# EAGLE design SSB Transceiver_MC1496 DSB Modulator (EAGLE 9.4.2)
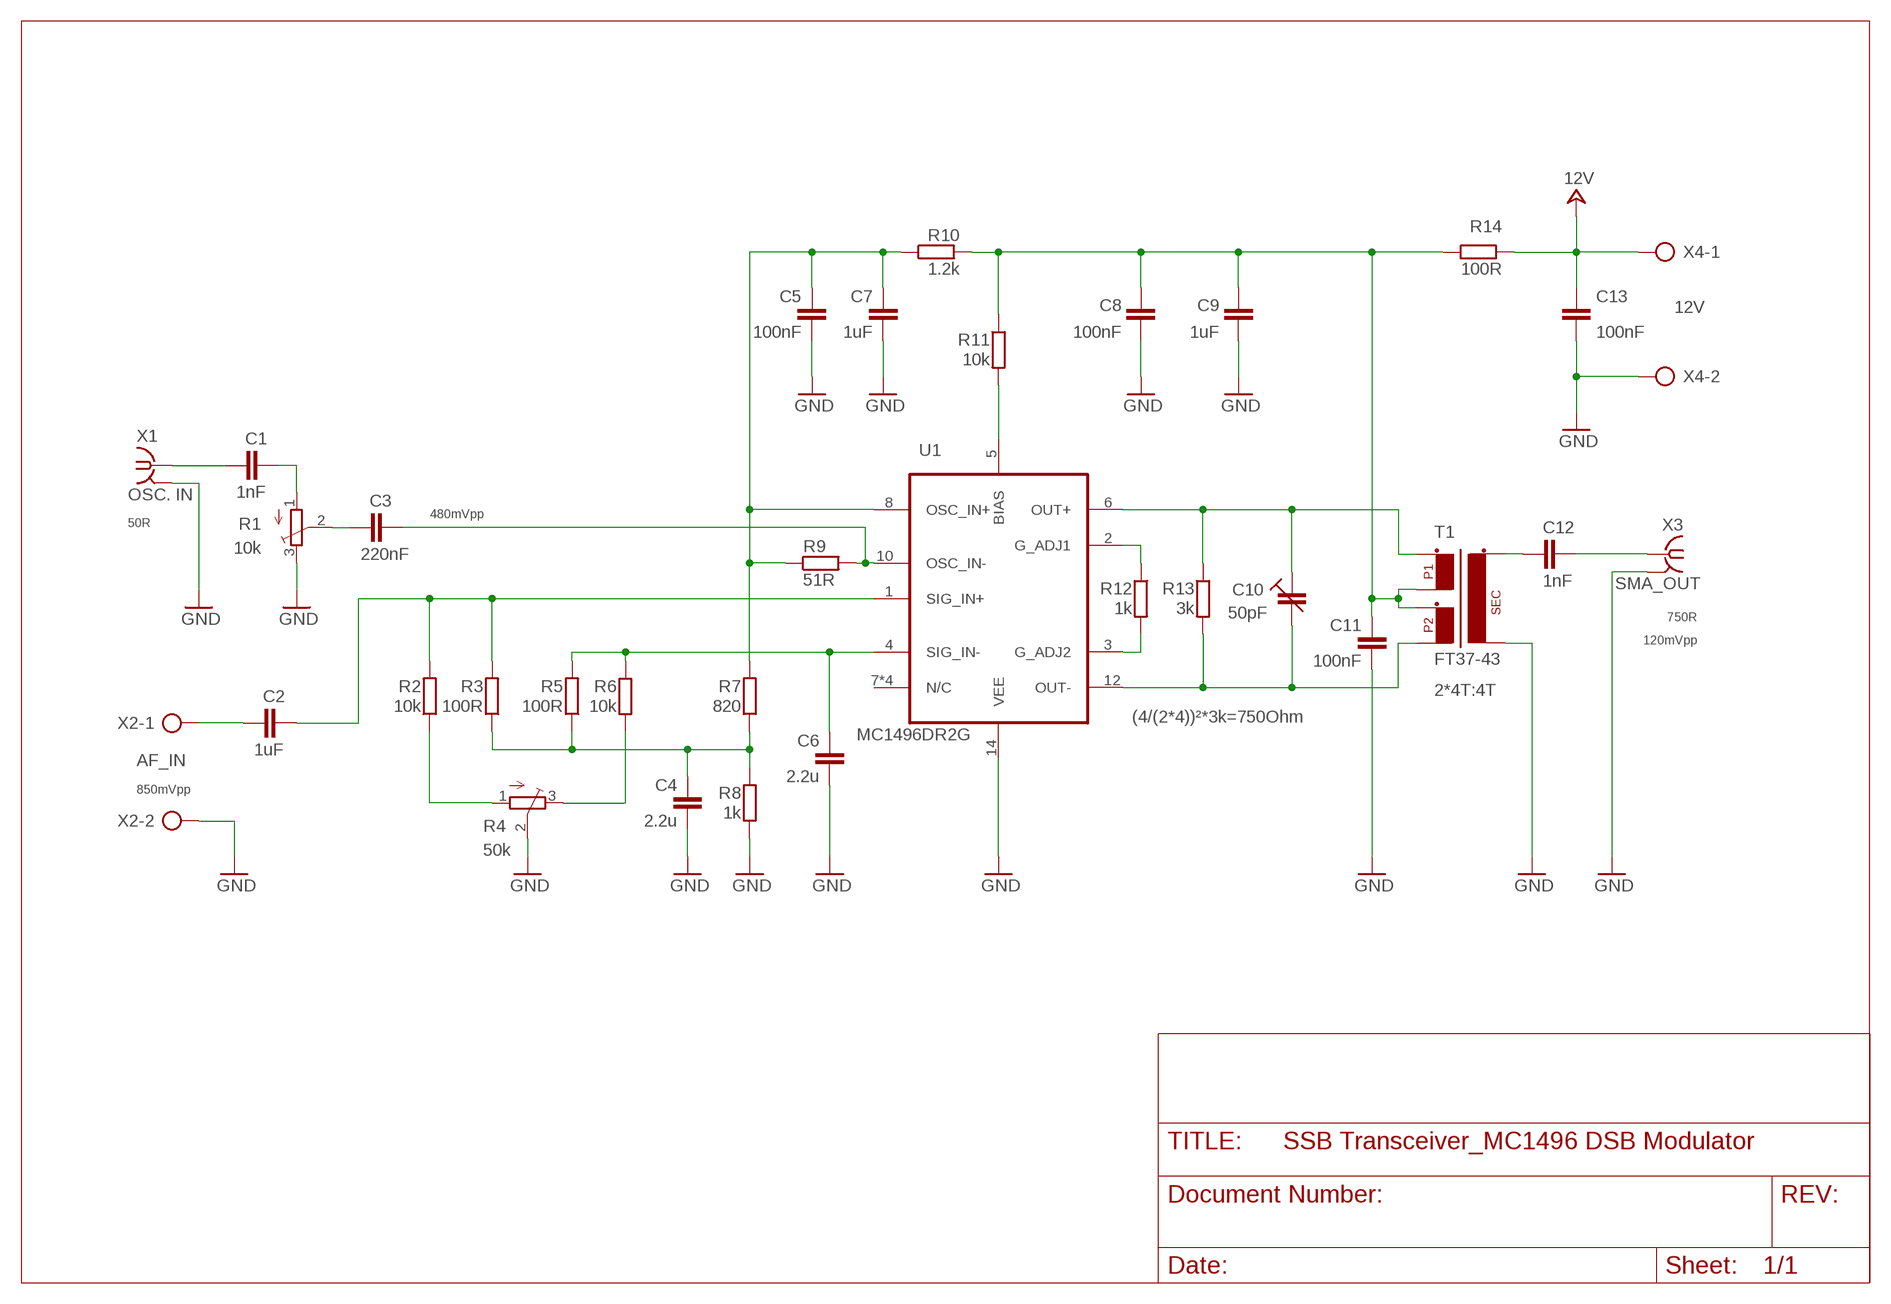
[diagram p0: schematic, sheet 1]

## Parts
C1  1nF  C-EUC0805  [C0805]
C2  1uF  C-EUC0805  [C0805]
C3  220nF  C-EUC0805  [C0805]
C4  2.2u  C-EUC0805  [C0805]
C5  100nF  C-EUC0805  [C0805]
C6  2.2u  C-EUC0805  [C0805]
C7  1uF  C-EUC0805  [C0805]
C8  100nF  C-EUC0805  [C0805]
C9  1uF  C-EUC0805  [C0805]
C10  50pF  VARIABLECAP  [VARIABLECAP-SMD]
C11  100nF  C-EUC0805  [C0805]
C12  1nF  C-EUC0805  [C0805]
C13  100nF  C-EUC0805  [C0805]
R1  10k  TRIM_EU-3223G  [3223G]
R2  10k  R-EU_R0805  [R0805]
R3  100R  R-EU_R0805  [R0805]
R4  50k  TRIM_EU-3223G  [3223G]
R5  100R  R-EU_R0805  [R0805]
R6  10k  R-EU_R0805  [R0805]
R7  820  R-EU_R0805  [R0805]
R8  1k  R-EU_R0805  [R0805]
R9  51R  R-EU_R0805  [R0805]
R10  1.2k  R-EU_R0805  [R0805]
R11  10k  R-EU_R0805  [R0805]
R12  1k  R-EU_R0805  [R0805]
R13  3k  R-EU_R0805  [R0805]
R14  100R  R-EU_R0805  [R0805]
T1  FT37-43  FT37-43CENTERTAP  [FT37-43CENTERTAPSMD]
U1  MC1496DR2G  [SOIC127P600X175-14N]
X1  OSC. IN  SMA-142-0711-821/826  [J502-ND-142-0711-821/826]
X2  AF_IN  AK300/2  [AK300/2]
X3  SMA_OUT  SMA-142-0711-821/826  [J502-ND-142-0711-821/826]
X4  12V  AK300/2  [AK300/2]

## Nets
+24V: C13.2 R14.2 X4.1 ; supply symbol labelled 12V
GND: C4.1 C5.1 C6.1 C7.1 C8.1 C9.1 C11.1 C13.1 R1.3(E) R4.2(S) R8.1 T1.S$2(S2) U1.14(VEE) X1.G@1 X1.G@2 X1.G@3 X1.G@4 X2.2 X3.G@1 X3.G@2 X3.G@3 X3.G@4 X4.2
N$1: C1.1 X1.1
N$2: C12.2 X3.1
N$3: C1.2 R1.1(A)
N$4: C3.1 R1.2(S)
N$5: C8.2 C9.2 C11.2 R10.2 R11.1 R14.1 T1.P$2(P1_2) T1.P$3(P2_1)
N$6: C12.1 T1.S$1(S1)
N$7: C10.P$1(E) R13.1 T1.P$1(P1_1) U1.6(OUT+)
N$8: C10.P$2(A) R13.2 T1.P$4(P2_2) U1.12(OUT-)
N$9: R12.2 U1.3(G_ADJ2)
N$10: R12.1 U1.2(G_ADJ1)
N$11: C3.2 R9.2 U1.10(OSC_IN-)
N$13: R11.2 U1.5(BIAS)
N$14: R2.1 R4.1(A)
N$15: R4.3(E) R6.2
N$16: C6.2 R5.2 R6.1 U1.4(SIG_IN-)
N$17: C2.2 R2.2 R3.2 U1.1(SIG_IN+)
N$18: C4.2 R3.1 R5.1 R7.1 R8.2
N$19: C2.1 X2.1
N$21: C5.2 C7.2 R7.2 R9.1 R10.1 U1.8(OSC_IN+)
Unconnected: U1.7(N/C) U1.9(N/C) U1.11(N/C) U1.13(N/C)

## Notes on the sheet
- 480mVpp
- 50R
- 750R
- 120mVpp
- 2*4T:4T
- (4/(2*4))²*3k=750Ohm
- 850mVpp

## Library data of the parts
C1-C9 C11-C13 = rcl:C-EU: CAPACITOR, European symbol; SPICEPREFIX: C
C10 = Ham Radio:VARIABLECAP
R1 R4 = pot:TRIM_EU-: POTENTIOMETER
R2 R3 R5-R14 = rcl:R-EU_: RESISTOR, European symbol; SPICEPREFIX: R
T1 = Ham Radio:FT37-43CENTERTAP
U1 = Ham Radio:MC1496DR2G; AVAILABILITY: Unavailable; DESCRIPTION: RF IC Modulator/Demodulator FM 300MHz 14-SOIC; MF: ON Semiconductor; MP: MC1496DR2G; PACKAGE: SOIC-14 ON Semiconductor; PRICE: None
X1 X3 = con-coax:SMA-: SMA 50 Ohm End Launch Jack Receptacle - Round Contact Johnson Components Source: www.johnsoncomponents.com .. J502-ND.pdf; MF: JOHNSON COMPONENTS; MPN: 142-0711-821; OC_FARNELL: 1019328; OC_NEWARK: 16F3627
X2 X4 = con-ptr500:AK300/2: CONNECTOR; OC_FARNELL: unknown; OC_NEWARK: unknown

## Board
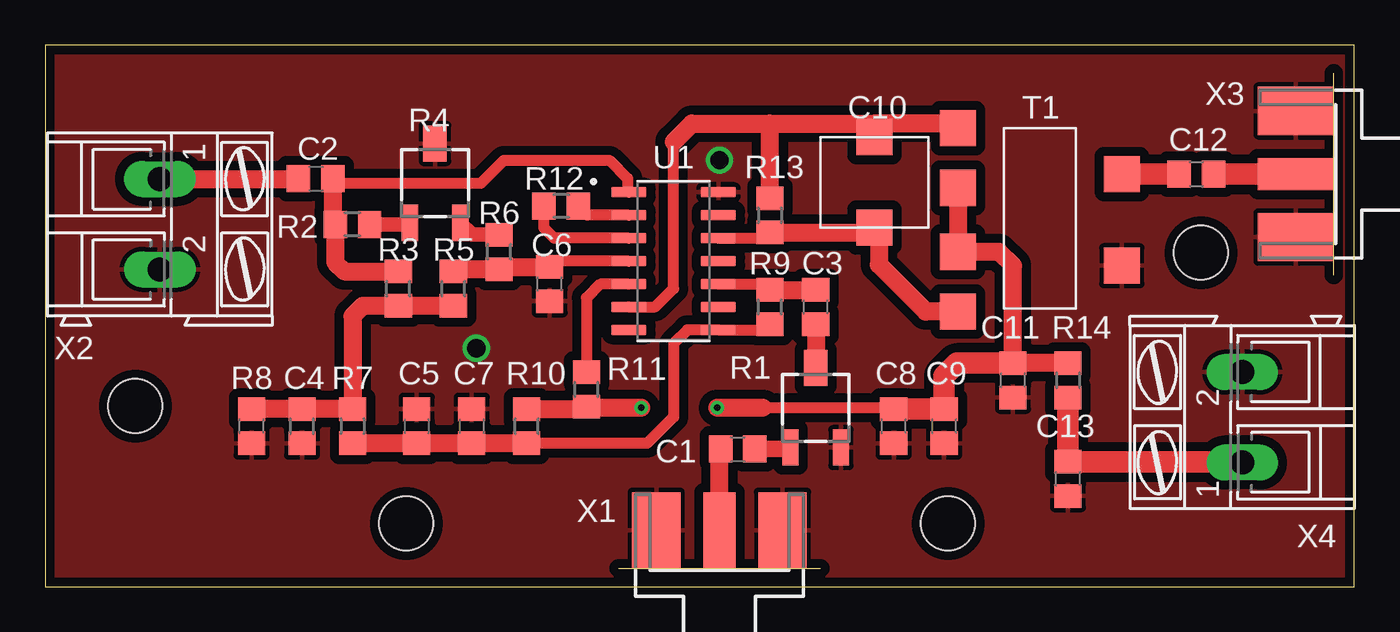
[diagram p1: board, top side]
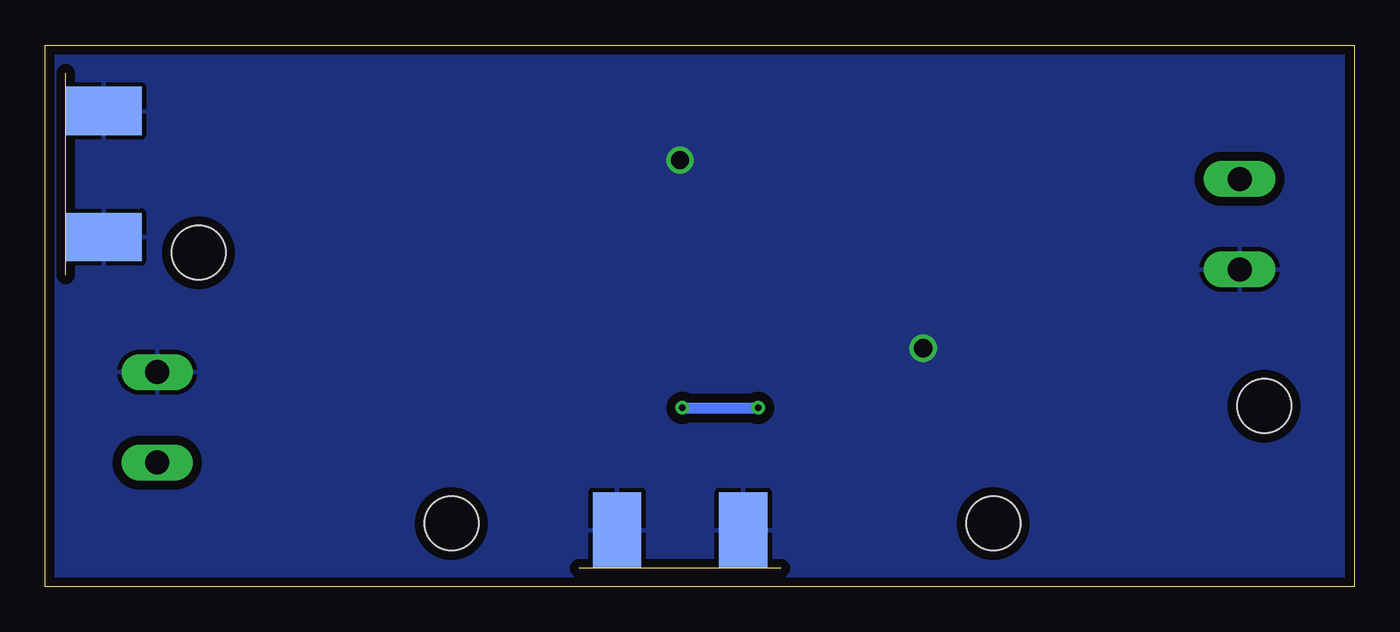
[diagram p2: board, bottom side, seen from below]

Size 72.5 x 30 mm. Coordinates in mm from the lower left corner, seen from the top.
Outline: 0,0 72.5,0 72.5,30 0,30 0,0
Copper layers (1*16): Top 0.035mm / dielectric 1.5mm / Bottom 0.035mm
Design rules "default *": minimum track width 6mil, minimum drill 0.35mm, track to track 20mil, track to pad 20mil, pad to pad 20mil, via to via 20mil, smd to smd 6mil, copper to edge 20mil, drill to drill 6mil, minimum pad ring 10mil, minimum via ring 8mil, stop-mask expansion 4mil, vias tented up to drill 0mil, thermal gap 10mil
Holes 3 mm at 5,10 64,18.5 20,3.5 50,3.5

### Footprints (pad centres in the part's own frame; a part is rotated, then mirrored left to right if it is on the bottom)
C0805 = smd 1.3 x 1.5: 1 -0.95,0; 2 0.95,0
VARIABLECAP-SMD = smd 2 x 2: P$1 0.46,2.54; P$2 0.46,-2.46
3223G = smd 2 x 0.9: 1 -2.2,1.4; 3 -2.2,-1.4 | smd 2 x 1.3: 2 2.2,0
R0805 = smd 1.3 x 1.5: 1 -0.95,0; 2 0.95,0
FT37-43CENTERTAPSMD = smd 2 x 2: P$1 -7.62,3.81; P$2 -7.62,0.5; P$3 -7.62,-3.04; P$4 -7.62,-6.35; S$1 1.46,1.27; S$2 1.46,-3.81
SOIC127P600X175-14N = smd 1.95 x 0.59: 1 -2.48,3.81; 2 -2.48,2.54; 3 -2.48,1.27; 4 -2.48,0; 5 -2.48,-1.27; 6 -2.48,-2.54; 7 -2.48,-3.81; 8 2.48,-3.81; 9 2.48,-2.54; 10 2.48,-1.27; 11 2.48,0; 12 2.48,1.27; 13 2.48,2.54; 14 2.48,3.81
J502-ND-142-0711-821/826 = smd 4.191 x 1.778: 1 2.115,0 | smd 4.191 x 2.667: G@1 2.115,3.495; G@2 2.115,-3.495 | smd 4.191 x 2.667 bottom: G@3 2.115,3.495; G@4 2.115,-3.495
AK300/2 = drill 1.321 long: 1 -2.515,0; 2 2.489,0

### Placement (x,y rotation side)
C1  38.35,7.62 0 top
C2  14.99,22.61 0 top
C3  42.67,15.49 90 top
C4  11.43,8.89 90 top
C5  20.57,8.89 270 top
C6  27.94,16.76 90 top
C7  23.62,8.89 270 top
C8  46.99,8.89 90 top
C9  49.78,8.89 90 top
C10  45.47,22.35 0 top
C11  53.59,11.43 90 top
C12  63.75,22.86 0 top
C13  56.64,5.97 90 top
R1  42.67,9.91 90 top
R2  17.02,20.07 180 top
R3  19.56,16.51 90 top
R4  21.59,22.35 90 top
R5  22.61,16.51 90 top
R6  25.15,18.54 90 top
R7  17.02,8.89 270 top
R8  14.22,8.89 90 top
R9  40.13,15.49 90 top
R10  26.67,8.89 90 top
R11  29.97,10.92 90 top
R12  28.57,21.08 180 top
R13  40.13,20.57 270 top
R14  56.64,11.43 270 top
T1  58.17,21.59 0 top
U1  34.8,18.03 0 top
X1  37.34,1.02 90 top
X2  6.35,20.07 270 top
X3  71.37,22.86 180 top
X4  66.29,9.4 90 top

### Tracks (layer width: path | path; a pad name or v marks a point on that pad's centre or on a via)
+24V
  Top 1.2: R14.2 C13.2 66.26,6.92 X4.1
GND  (via drill 1)
  other vias: 23.88,13.21 37.34,23.62
  pour Top (isolate 0.5): 0,0 0,30 72.5,30 72.5,0
  pour Bottom (isolate 0.5): 0,0 0,30 72.5,30 72.5,0
N$1
  Top 1: X1.1 37.34,7.55 C1.1
N$2
  Top 1.2: C12.2 X3.1
N$3
  Top 0.9: R1.1 41.19,7.62 C1.2
N$4
  Top 1: C3.1 R1.2
N$5  (via drill 0.35)
  Top 0.6: 39.75,9.91 46.92,9.91 C8.2
  Top 1: R10.2 29.84,9.84 R11.1 30.04,9.91 v33.02,9.91 | T1.P$2 T1.P$3 52.82,18.55 53.59,17.78 C11.2 R14.1 | 39.75,9.91 v37.21,9.91
  Top 1.2: C11.2 50.48,12.38 49.78,11.68 C9.2 C8.2
  Bottom 0.6: v37.21,9.91 v33.02,9.91
N$6
  Top 1.2: T1.S$1 C12.1
N$7
  Top 0.6: U1.6 33.78,15.49 34.8,16.51 34.8,24.64
  Top 1: 34.8,24.64 35.81,25.65 40.13,25.65 | 40.13,25.65 45.93,25.65 | 45.93,25.65 50.29,25.65 T1.P$1 | C10.P$1 45.93,25.65 | R13.1 40.13,25.65
N$8
  Top 0.6: U1.12 39.81,19.3 R13.2
  Top 1: R13.2 45.4,19.62 45.4,19.37 C10.P$2 46.17,19.65 46.17,17.84 48.77,15.24 T1.P$4
N$9
  Top 0.6: U1.3 28.19,19.3 27.62,19.87 R12.2
N$10
  Top 0.6: U1.2 30.03,20.57 R12.1
N$11
  Top 0.6: U1.10 39.81,16.76 R9.2
  Top 1: R9.2 C3.2
N$13
  Top 0.6: U1.5 30.73,16.76 29.97,16 R11.2
N$14
  Top 0.8: R4.1 20.1,20.07 R2.1
N$15
  Top 0.8: R4.3 23.65,19.49 R6.2
N$16
  Top 0.6: U1.4 28.26,18.03 C6.2
  Top 1: C6.2 25.27,17.71 R6.1 22.74,17.59 R5.2
N$17
  Top 0.6: U1.1 32.26,21.9 32.26,22.61 31.24,23.62 25.4,23.62 24.13,22.35 16.19,22.35 C2.2
  Top 1: C2.2 15.94,20.2 R2.2 16.07,17.97 16.58,17.46 R3.2
N$18
  Top 1: R5.1 R3.1 17.59,15.56 17.02,14.99 R7.1 R8.2 C4.2
N$19
  Top 1: X2.1 14.01,22.58 C2.1
N$21
  Top 0.6: R9.1 39.81,14.22 U1.8 35.56,14.22 34.8,13.46 34.8,9.4 33.34,7.94 R10.1
  Top 1: R7.2 C5.2 C7.2 R10.1